# EAGLE design LM3409.v03 (EAGLE 5.11)
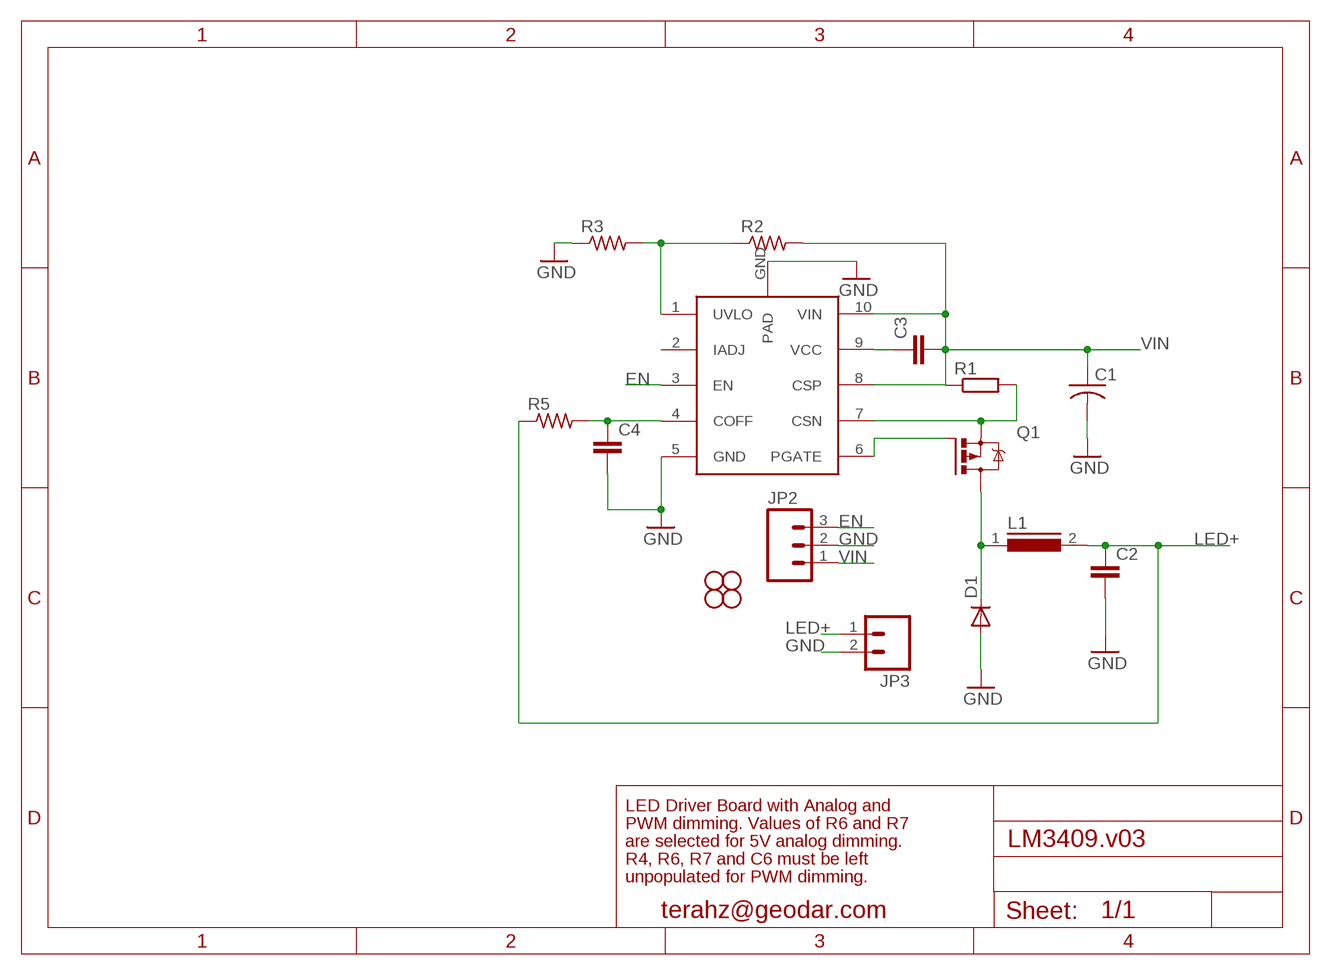
[diagram p0: schematic, sheet 1]

## Parts
C1  C-USC1210  [C1210]
C2  C-EUC1210  [C1210]
C3  CAP1206  [C1206]
C4  CAP1206  [C1206]
D1  DIODE-SMC  [SMC]
JP2  M03SCREW  [SCREWTERMINAL-3.5MM-3]
JP3  M023.5MM  [SCREWTERMINAL-3.5MM-2]
JP4  STAND-OFF  [STAND-OFF]
JP5  STAND-OFF  [STAND-OFF]
JP6  STAND-OFF  [STAND-OFF]
JP7  STAND-OFF  [STAND-OFF]
L1  DR125  [DR125]
Q1  IRFR5305  [D-PAK_TO252AA]
R1  R-EU_R2512  [R2512]
R2  R-US_R1206  [R1206]
R3  R-US_R1206  [R1206]
R5  R-US_R1206  [R1206]
U$1  LM3409  [MSOP-10-GNDPAD]

## Nets
EN: JP2.3 U$1.3(EN)
GND: C1.2 C2.2 C4.2 D1.A JP2.2 JP3.2 R3.1 U$1.5(GND) U$1.GND(PAD)
LED+: C2.1 JP3.1 L1.2 R5.1
N$2: Q1.3(S) R1.2 U$1.7(CSN)
N$3: C4.1 R5.2 U$1.4(COFF)
N$4: R2.1 R3.2 U$1.1(UVLO)
N$5: C3.1 U$1.9(VCC)
N$6: D1.C L1.1 Q1.4(D)
N$7: Q1.1(G) U$1.6(PGATE)
VIN: C1.1 C3.2 JP2.1 R1.1 R2.2 U$1.8(CSP) U$1.10(VIN)
Unconnected: U$1.2(IADJ)

## Notes on the sheet
- LED Driver Board with Analog and
- PWM dimming. Values of R6 and R7
- are selected for 5V analog dimming.
- R4, R6, R7 and C6 must be left
- unpopulated for PWM dimming.
- terahz@geodar.com

## Library data of the parts
C1 = resistor:C-US: CAPACITOR, American symbol
C2 = resistor:C-EU: CAPACITOR, European symbol
C3 C4 = _allyourbase:CAP: Capacitor Standard 0603 ceramic capacitor, and 0.1" leaded capacitor.
D1 = diode:DIODE-: DIODE
JP2 = SparkFun:M03: Header 3 Standard 3-pin 0.1" header. Use with straight break away headers (SKU : PRT-00116), right angle break away headers (PRT-00553), swiss pins (PRT-00743), machine pins (PRT-00117), and female headers (PRT-00115). Molex polarized connector foot print use with SKU : PRT-08232 with associated crimp pins and housings.
JP3 = SparkFun:M02: Header 2 Standard 2-pin 0.1" header. Use with straight break away headers (SKU : PRT-00116), right angle break away headers (PRT-00553), swiss pins (PRT-00743), machine pins (PRT-00117), and female headers (PRT-00115). Molex polarized connector foot print use with SKU : PRT-08233 with associated crimp pins and housings.
JP4-JP7 = SparkFun:STAND-OFF: Stand Off This is the mechanical footprint for a #4 phillips button head screw. Use the keepout ring to avoid running the screw head into surrounding components. SKU : PRT-00447
L1 = LM3409:DR125: High Power Density, High Efficiency, Shielded Inductors Source: coiltronics_dr_series.pdf
Q1 = LM3409:IRF?5305: HEXFET Power MOSFET Source: http://www.irf.com/product-info/datasheets/data/irfr5305pbf.pdf
R1 = resistor:R-EU_: RESISTOR, European symbol
R2 R3 R5 = _allyourbase:R-US_: RESISTOR, American symbol
U$1 = LM3409:LM3409

## Board
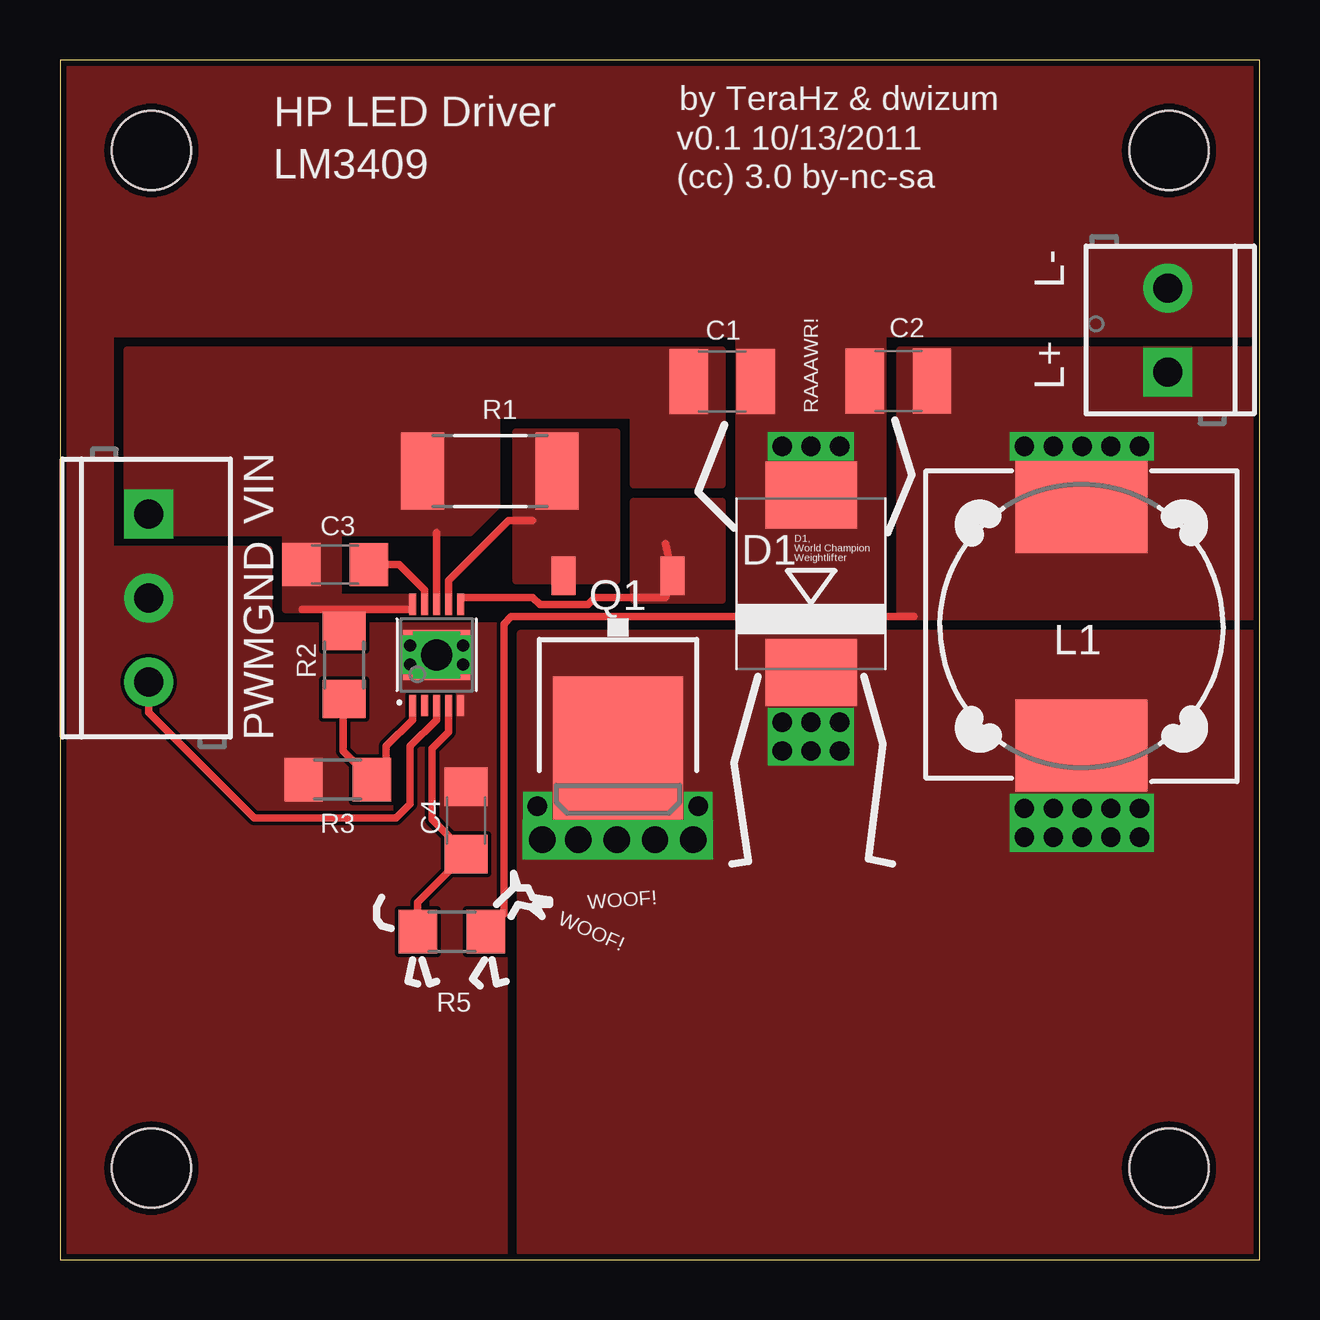
[diagram p1: board, top side]
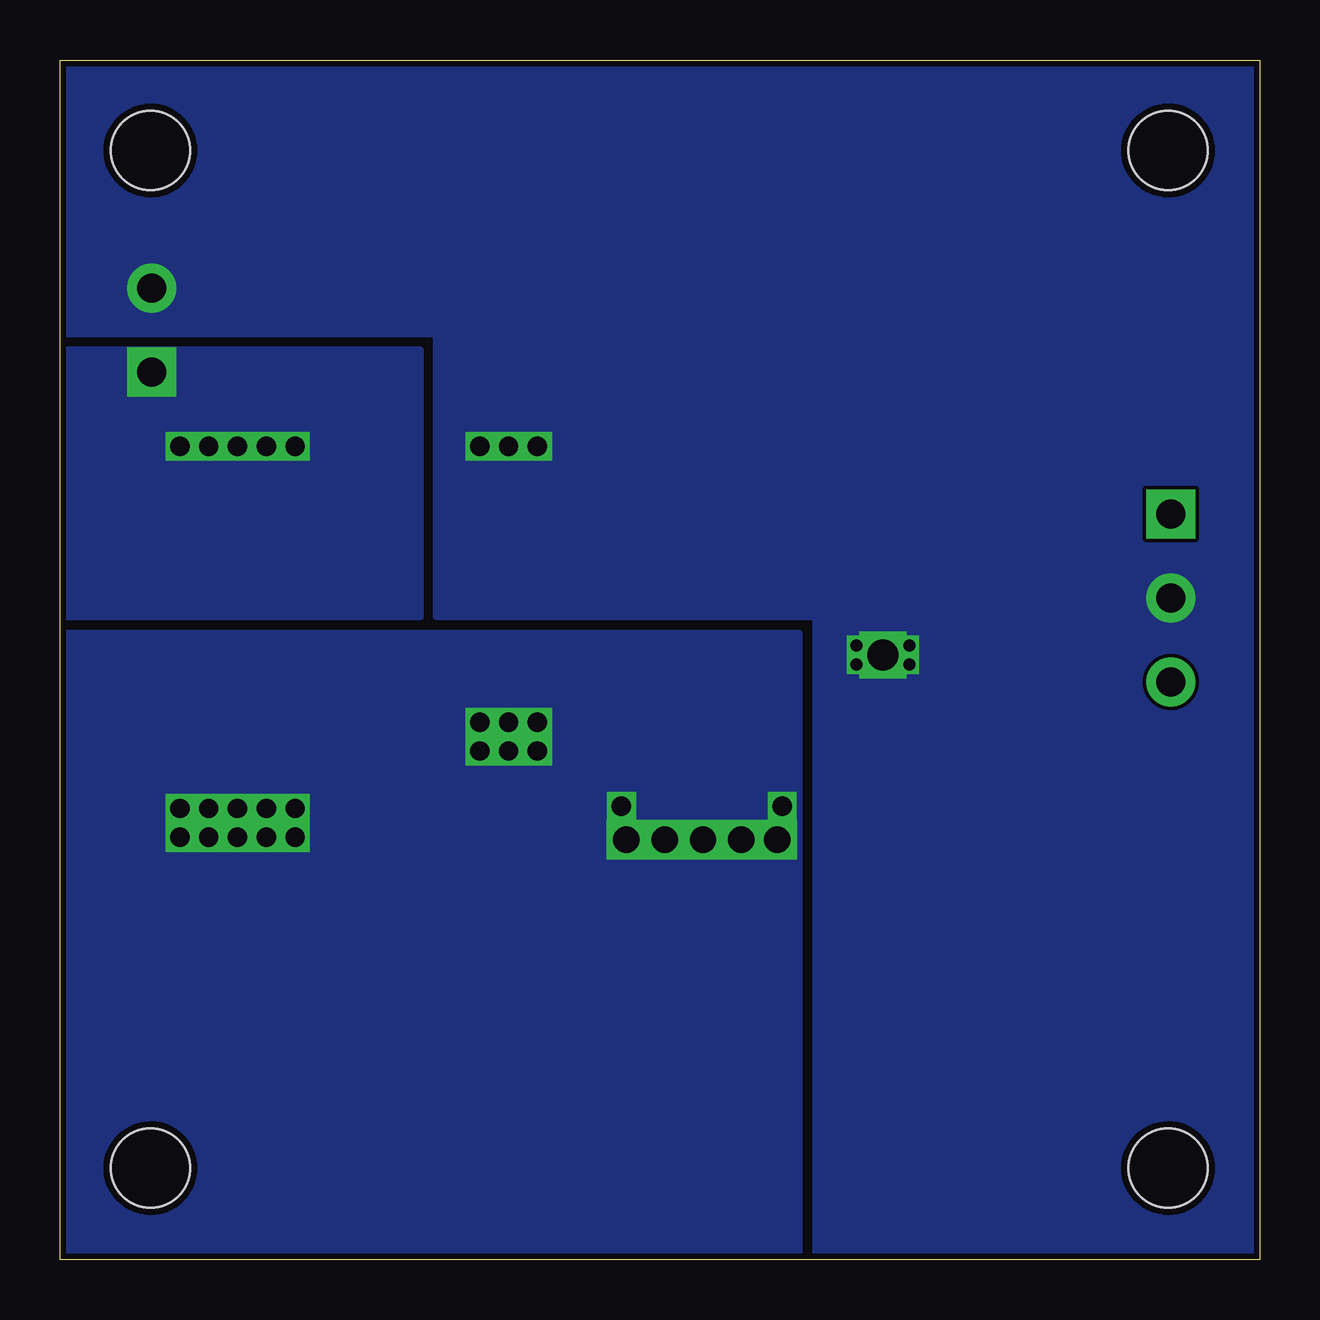
[diagram p2: board, bottom side, seen from below]

Size 50 x 50 mm. Coordinates in mm from the lower left corner, seen from the top.
Outline: 0,0 50,0 50,50 0,50 0,0
Copper layers (1*16): Top 0.035mm / dielectric 1.5mm / Bottom 0.035mm
Design rules "iTead-Seeed-DRC": minimum track width 6mil, minimum drill 12mil, track to track 6mil, track to pad 6mil, pad to pad 6mil, via to via 6mil, smd to smd 0mil, copper to edge 10mil, drill to drill 10mil, minimum pad ring 10mil, minimum via ring 6mil, stop-mask expansion 2mil, vias tented up to drill 100mil, thermal gap 10mil

### Footprints (pad centres in the part's own frame; a part is rotated, then mirrored left to right if it is on the bottom)
C1210 = smd 1.6 x 2.7: 1 -1.4,0; 2 1.4,0
C1206 = smd 1.6 x 1.8: 1 -1.4,0; 2 1.4,0
SMC = smd 2.8 x 3.8: A 3.7,0; C -3.7,0
SCREWTERMINAL-3.5MM-3 = drill 1.2 pad 2.032 square: 1 0,0 | drill 1.2 pad 2.032 round: 2 3.5,0; 3 7,0
SCREWTERMINAL-3.5MM-2 = drill 1.2 pad 2.032 square: 1 0,0 | drill 1.2 pad 2.032 round: 2 3.5,0
STAND-OFF = hole 3.302: 0,0
DR125 = smd 3.85 x 5.5: 1 -4.975,0; 2 4.975,0
D-PAK_TO252AA = smd 1 x 1.6: 1 -2.28,-4.8; 3 2.28,-4.8 | smd 5.4 x 6.2: 4 0,2.5
R2512 = smd 1.8 x 3.2: 1 -2.8,0; 2 2.8,0
R1206 = smd 1.6 x 1.803: 1 -1.422,0; 2 1.422,0
MSOP-10-GNDPAD = smd 0.305 x 0.889: 1 -1,-2.11; 2 -0.5,-2.11; 3 0,-2.11; 4 0.5,-2.11; 5 1,-2.11; 6 1,2.11; 7 0.5,2.11; 8 0,2.11; 9 -0.5,2.11; 10 -1,2.11 | smd 2.794 x 2.083: GND 0,0

### Placement (x,y rotation side)
C1  27.61,36.59 0 top
C2  34.95,36.62 180 top
C3  11.47,28.97 180 top
C4  16.93,18.3 90 top
D1  31.31,28.17 90 top
JP2  3.7,31.07 270 top
JP3  46.18,36.99 90 top
JP4  46.23,3.81 0 top
JP5  3.81,3.81 0 top
JP6  46.23,46.23 0 top
JP7  3.81,46.23 0 top
L1  42.58,26.4 90 top
Q1  23.26,23.7 180 top
R1  17.92,32.86 0 top
R2  11.85,24.78 90 top
R3  11.58,20 0 top
R5  16.33,13.67 180 top
U$1  15.7,25.2 0 top

### Tracks (layer width: path | path; a pad name or v marks a point on that pad's centre or on a via)
EN
  Top 0.305: U$1.3 15.7,22.5 14.6,21.4 14.6,19 14,18.4 8.1,18.4 3.7,22.8 JP2.3
GND  (via drill 0.5, 0.8, 1.3)
  other vias: 15.7,25.2 31.3,33.9 30.1,33.9 32.5,33.9 14.6,25.6 14.6,24.8 16.8,25.6 16.8,24.8
  pour Bottom (no thermals): 0,50 50,50 49.9,38.6 34.3,38.6 34.3,26.8 18.5,26.8 18.5,0.1 0,0
  pour Top (no thermals): 2.1,38.6 28.3,38.6 28.3,27.5 34.3,27.5 34.3,38.6 49.9,38.6 49.9,50 0,50 0,0.1 18.5,0 18.5,26.4 8.7,26.4 8.7,29.6 2.1,29.6
LED+  (via drill 0.8)
  Top 0.305: 35.6,26.8 18.8,26.8 18.5,26.5 18.5,14.41 R5.1
  other vias: 40.2,33.9 41.4,33.9 42.6,33.9 43.8,33.9 45,33.9
  pour Top (no thermals): 49.7,37.9 49.8,26.8 35,26.8 35,37.9
  pour Bottom (no thermals): 49.7,37.9 49.8,26.8 35,26.8 35,37.9
N$2
  Top 0.305: U$1.7 16.2,28.3 18.7,30.8 19.7,30.8 | Q1.3 20.68,28.4
  pour Top (no thermals): 23.2,28.3 23.2,34.5 19,34.5 19,28.3
N$3
  Top 0.305: R5.2 14.91,14.88 C4.1 15.5,18.34 15.5,21.3 16.2,22 U$1.4
N$4
  Top 0.305: 12.12,23.09 R2.1 11.8,23.32 11.8,21.2 R3.2 13.6,20.4 13.6,21.4 14.7,22.5 U$1.1
N$5
  Top 0.305: U$1.9 15.2,27.9 14.13,28.97 C3.1
N$6  (via drill 0.8, 1.1)
  other vias: 24.8,17.5 20.1,17.5 21.6,17.5 23.2,17.5 30.1,22.4 31.3,22.4 32.5,22.4 41.4,18.8 42.6,18.8 43.8,18.8 45,18.8 26.4,17.5 40.2,18.8 40.2,17.6 41.4,17.6 42.6,17.6 43.8,17.6 45,17.6 30.1,21.2 31.3,21.2 32.5,21.2 26.6,18.9 19.9,18.9
  pour Top (no thermals): 19.2,26.1 19.2,0 50,0.1 50,26.1
  pour Bottom (no thermals): 50,26.1 19.2,26.1 19.2,0.3 50,0.1
N$7
  Top 0.305: 25.24,29.84 Q1.1 25.24,27.6 22.3,27.6 22,27.3 20,27.3 19.7,27.6 16.7,27.6 U$1.6
  pour Top (no thermals): 23.9,31.6 27.6,31.6 27.6,27.5 23.9,27.5
VIN
  Top 0.305: 11.9,26.21 R2.2 11.8,26.21 11.8,27.1 | U$1.8 15.7,30.3 | 10.1,27.1 11.8,27.1 | 11.8,27.1 14.7,27.1 U$1.10
  pour Top (no thermals): 27.6,37.9 2.8,37.9 2.8,30.3 9.4,30.3 9.4,27.1 14.7,27.1 14.7,27.6 11.6,27.6 11.6,30.3 17.1,30.3 18.2,31.4 18.2,35.2 23.9,35.2 23.9,32.3 27.6,32.3

### Text on the board
tPlace: by TeraHz & dwizum | HP LED Driver | v0.1 10/13/2011 | LM3409 | (cc) 3.0 by-nc-sa | RAAAWR! | D1, | World Champion | Weightlifter | WOOF! | WOOF!
tNames: L- | L+ | VIN | GND | PWM